# Altium schematic sheet PX4FLOW2.0_Connectors_X0.SchDoc
size A3; DrawnBy: Philip Rowse
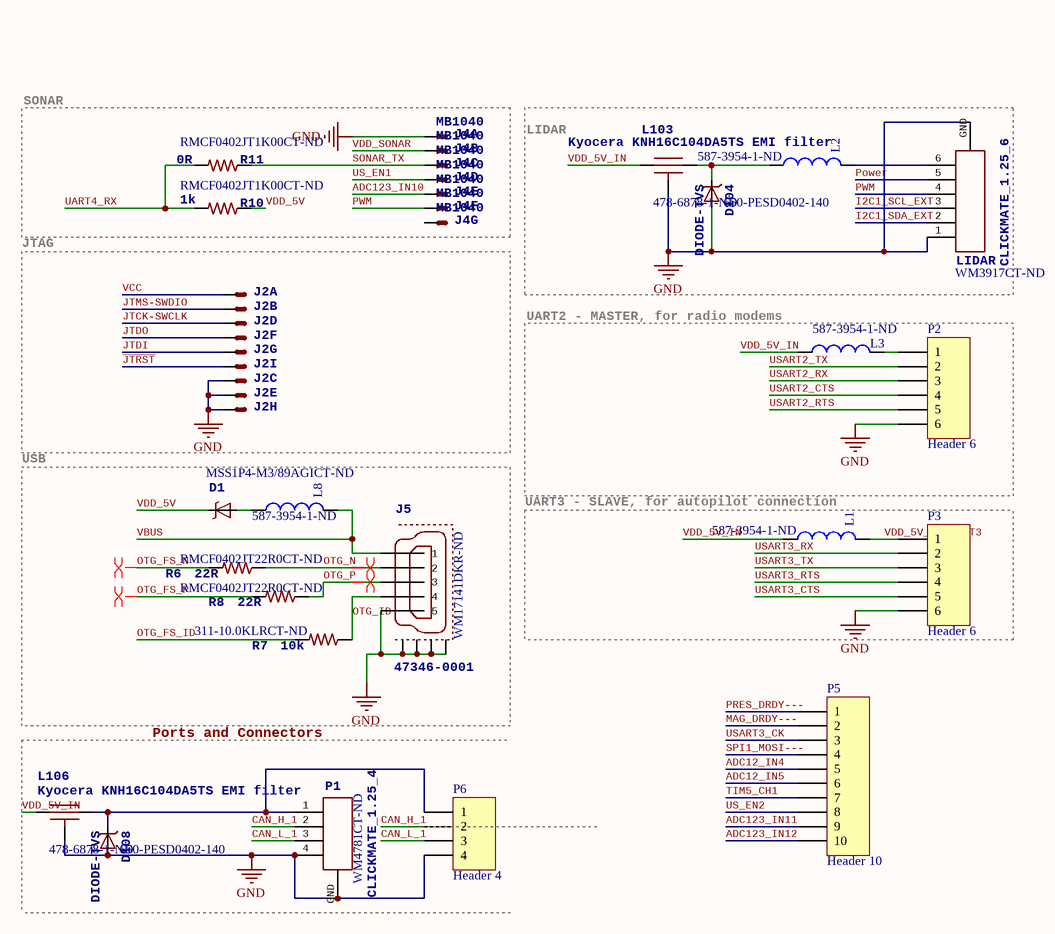
[diagram p0: PX4FLOW2.0_Connectors_X0.SchDoc]

## Parts
D1  Supplier Part Number 1: MSS1P4-M3/89AGICT-ND  [MICROSMP]  (hidden comment: MSS1P4-M3)
D104  DIODE-TVS  Supplier Part Number 1: 650-PESD0402-140  [0402-TVS]
D108  DIODE-TVS  Supplier Part Number 1: 650-PESD0402-140  [0402-TVS]
J2  (no value)  [FTSH-105-01-XXX-DV-K]  (parts A,B,C,D,E,F,G,H,I of 9)
J4  MB1040  [MAXSONAR]  (parts A,B,C,D,E,F,G of 7)
J5  47346-0001  Supplier Part Number 1: WM17141DKR-ND  [MOLEX-47346-0001]
L1  Supplier Part Number 1: 587-3954-1-ND  [L0402]  (hidden comment: Inductor)
L2  Supplier Part Number 1: 587-3954-1-ND  [L0402]  (hidden comment: Inductor)
L3  Supplier Part Number 1: 587-3954-1-ND  [L0402]  (hidden comment: Inductor)
L8  Supplier Part Number 1: 587-3954-1-ND  [L0402]  (hidden comment: FERRITE BEAD 120 OHM 0402)
L103  Kyocera KNH16C104DA5TS EMI filter  Supplier Part Number 1: 478-6878-1-ND  [KYOCERA-KNH16-DA]
L106  Kyocera KNH16C104DA5TS EMI filter  Supplier Part Number 1: 478-6878-1-ND  [KYOCERA-KNH16-DA]
LIDAR  CLICKMATE_1.25_6  Supplier Part Number 1: WM3917CT-ND  [CLICKMATE_H6]
P1  CLICKMATE_1.25_4  Supplier Part Number 1: WM4781CT-ND  [CLICKMATE_V4]
P2  Header 6  [HDR1X6]
P3  Header 6  [HDR1X6]
P5  Header 10  [HDR1X10]
P6  Header 4  [HDR1X4]
R6  22R  Supplier Part Number 1: RMCF0402JT22R0CT-ND  [R0402]
R7  10k  Supplier Part Number 1: 311-10.0KLRCT-ND  [R0402]
R8  22R  Supplier Part Number 1: RMCF0402JT22R0CT-ND  [R0402]
R10  1k  Supplier Part Number 1: RMCF0402JT1K00CT-ND  [R0402]
R11  0R  Supplier Part Number 1: RMCF0402JT1K00CT-ND  [R0402]

## Blocks framed on the sheet
SONAR: J4 R10 R11
LIDAR: D104 L2 L103 LIDAR
JTAG: J2
UART2 - MASTER, for radio modems: L3 P2
USB: D1 J5 L8 R6-R8
UART3 - SLAVE, for autopilot connection: L1 P3

## Nets
GND: D104.A D108.A J2.3(S) J2.5(S) J2.9(S) J4.GND(S) J5.GND(5) J5.GND1 J5.GND2 J5.GND3 J5.GND4 L103.GND L106.GND LIDAR.1 LIDAR.GND P1.4 P1.GND P2.6 P3.6 P6.4
ADC12_IN4: P5.5
ADC12_IN5: P5.6
ADC123_IN10: J4.AN(S)
ADC123_IN11: P5.9
ADC123_IN12: P5.10
CAN_H_1: P1.2 P6.2
CAN_L_1: P1.3 P6.3
I2C1_SCL_EXT: LIDAR.3
I2C1_SDA_EXT: LIDAR.2
~{JTRST}: J2.10(S)
JTCK-SWCLK: J2.4(S)
JTDI: J2.8(S)
JTDO: J2.6(S)
JTMS-SWDIO: J2.2(S)
MAG_DRDY---: P5.2
OTG_FS_ID: R7.2
OTG_FS_N: R6.2
OTG_FS_P: R8.2
OTG_ID: J5.ID(4) R7.1
OTG_N: J5.D-(2) R6.1
OTG_P: J5.D+(3) R8.1
Power: LIDAR.5
PRES_DRDY---: P5.1
PWM: J4.PW(S) LIDAR.4
SONAR_TX: J4.TX(S) R11.1
SPI1_MOSI---: P5.4
TIM5_CH1: P5.7
UART4_RX: R10.2 R11.2
US_EN1: J4.RX(S)
US_EN2: P5.8
USART2_CTS: P2.4
USART2_RTS: P2.5
USART2_RX: P2.3
USART2_TX: P2.2
USART3_CK: P5.3
USART3_CTS: P3.5
USART3_RTS: P3.4
USART3_RX: P3.2
USART3_TX: P3.3
VBUS: J5.VBUS(1) L8.2
VCC: J2.1(S)
VDD_5V: D1.CATHODE(C) R10.1
VDD_5V_IN: L1.1 L3.1 L103.P$1 L106.P$1
VDD_5V_IN_UART3: L1.2 P3.1
VDD_SONAR: J4.VDD(S)
NetD1_ANODE: D1.ANODE(A) L8.1
NetD104_C: D104.C L2.1 L103.P$2
NetD108_C: D108.C L106.P$2 P1.1 P6.1
NetL2_2: L2.2 LIDAR.6
NetL3_2: L3.2 P2.1

Not connected (* = marked no-connect by the designer): J4 BW(S)

## Layout directives
differential pair: OTG_FS_N, OTG_FS_P, OTG_N, OTG_P

## Notes on the sheet
- Ports and Connectors
- http://www.oshwa.org/
- http://creativecommons.org/licenses/by-sa/3.0/
- Title:
- Date:
- Time:
- Sheet:
- Approved:
- of:
- Drawn By:
- Checked By:
- ProfiCNC

## Library data of the parts
D1 = DIODE-SCHOTTKY_MSMP: Schottky barrier diode in DO214AC, e.g. Fairchild SS14.; Supplier 1: Digi-Key
D104 D108 = DIODE-TVS: Diode, TVS, 14VWM, 40VC, 0402, SMD; 3DR_PARTNO: ECM0837; Supplier 1: Mouser
J2 = ARM_MINI_JTAG-SMT
J4 = MAXSONAR: BOM: EXCLUDE; PARTNO: *
J5 = MOLEX-47346-0001: MICRO USB B, BOTTOM MOUNT; 3DR_PARTNO: ECM0486; PARTNO: 0473460001; Supplier 1: Digi-Key
L1-L3 = Inductor: FERRITE BEAD 120 OHM 0402; Supplier 1: Digi-Key
L8 = Inductor: Supplier 1: Digi-Key
L103 L106 = KNH16C104DA5TS: Capacitor, Filter, 0.1uF, 25V, 2A, 0603, SMD; 3DR_PARTNO: ECM0719; Supplier 1: Digi-Key
LIDAR = CLICKMATE_1.25_6: 1.25 W/B SGL R/A REC ASSY 6CKT; 3DR_PARTNO: ECM0532; Supplier 1: Digi-Key
P1 = CLICKMATE_1.25_4: Connector, Rcpt, 4Pos, 1.25MM, W/B, VERT, SMD, Tin; 3DR_PARTNO: PRT0441; Supplier 1: Digi-Key
P2 P3 = Header 6: Header, 6-Pin; LatestRevisionDate: 17-Jul-2002; LatestRevisionNote: Re-released for DXP Platform.; Publisher: Altium Limited
P5 = Header 10: Header, 10-Pin; LatestRevisionDate: 17-Jul-2002; LatestRevisionNote: Re-released for DXP Platform.; Publisher: Altium Limited
P6 = Header 4: Header, 4-Pin; LatestRevisionDate: 17-Jul-2002; LatestRevisionNote: Re-released for DXP Platform.; Publisher: Altium Limited
R6 R8 = RESISTOR0402-RES: ResistorBasic schematic elements and footprints for 0603, 1206, and PTH 1/10th watt (small) resistors.; PARTNO: RMCF0402JT22R0; Supplier 1: Digi-Key
R7 = RESISTOR0402-RES: RES 10K OHM 1/16W 1% 0402 SMD; PARTNO: MFR-25FBF-10K0; Supplier 1: Digi-Key
R10 R11 = RESISTOR0402-RES: ResistorBasic schematic elements and footprints for 0603, 1206, and PTH 1/10th watt (small) resistors.; PARTNO: RMCF0402JT1K00; Supplier 1: Digi-Key